# Altium project PCB_Project.PrjPCB
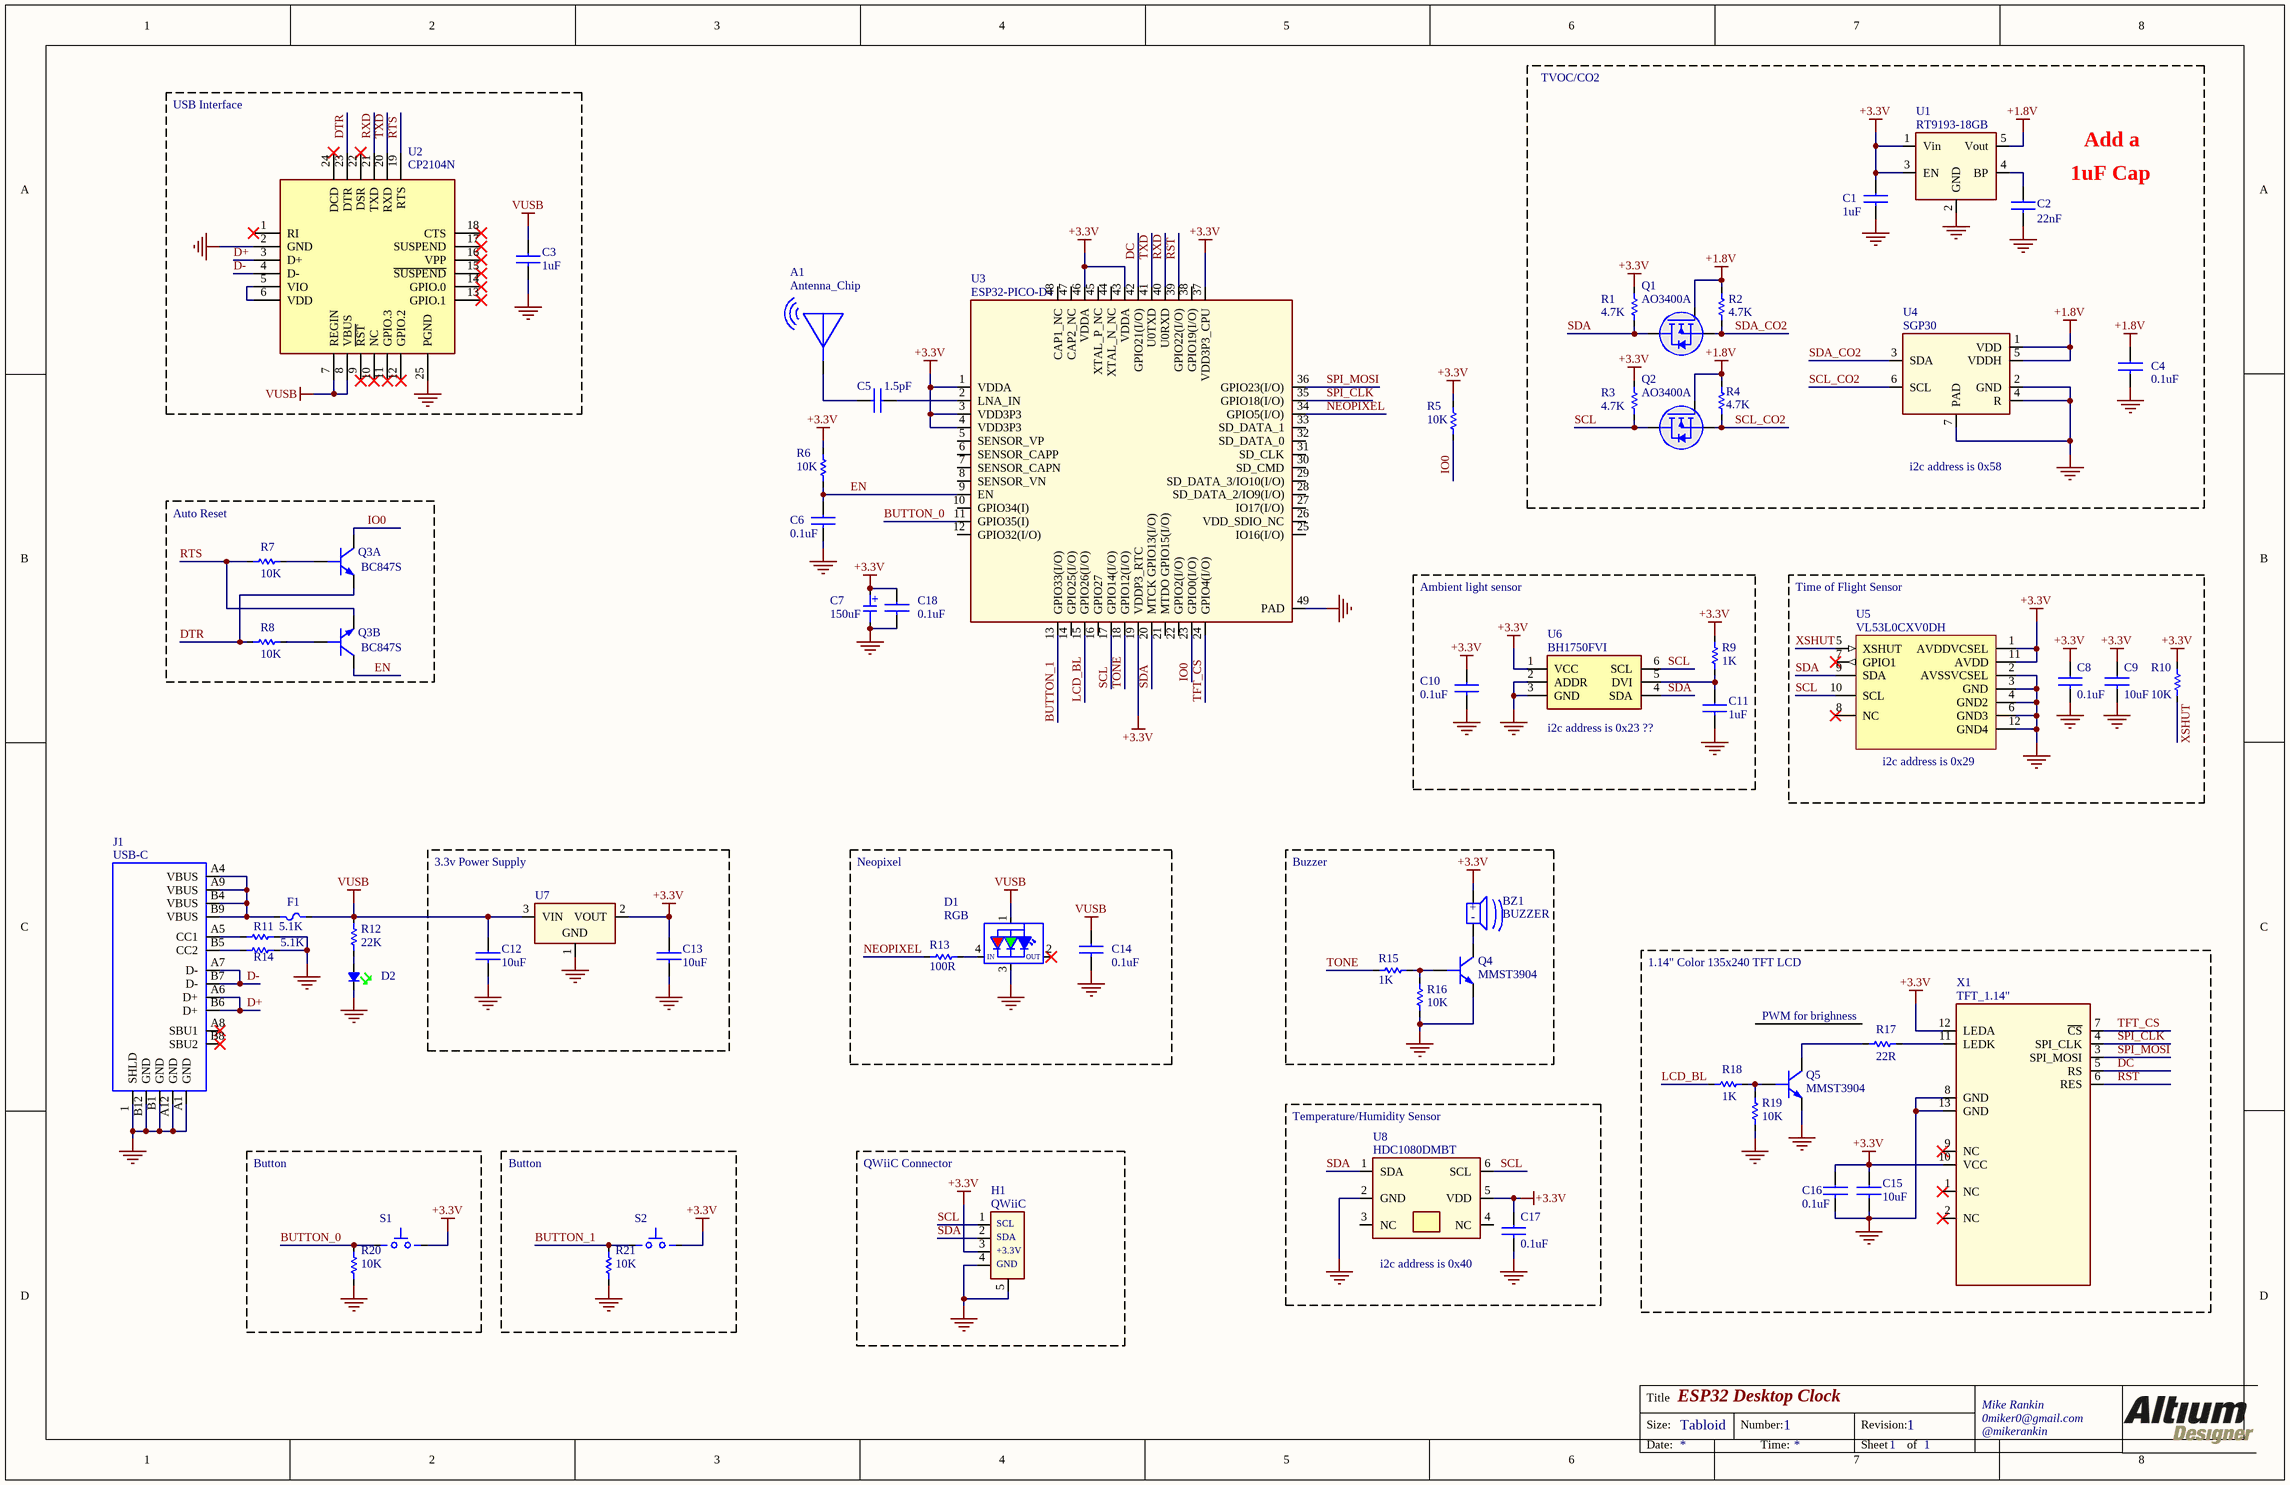
[diagram p0: Schematic_Rev1.SchDoc]
1 sheet, 62 parts. Net scope: global (net labels, ports and power ports of the same name join across sheets).
Board file: PCB_Rev1.PcbDoc

## Sheet Schematic_Rev1.SchDoc: ESP32 Desktop Clock
size Tabloid; DrawnBy: x; Engineer: x; Address1: Mike Rankin; Address2: 0miker0@gmail.com; Address3: @mikerankin; DocumentNumber: 1; Revision: 1; SheetNumber: 1; SheetTotal: 1; ImagePath: x

### Parts
A1  Antenna_Chip  [AN9520-245]
BZ1  BUZZER  [ST-025BH]
C1  1uF  [CAPC1005X56N]
C2  22nF  [CAPC1005X56N]
C3  1uF  [CAPC1005X56N]
C4  0.1uF  [CAPC1005X56N]
C5  1.5pF  [CAPC1005X56N]
C6  0.1uF  [CAPC1005X56N]
C7  150uF  [CAP_SM_CAN_0.250_DIA]
C8  0.1uF  [CAPC1005X56N]
C9  10uF  [CAPC2012X140N]
C10  0.1uF  [CAPC1005X56N]
C11  1uF  [CAPC1005X56N]
C12  10uF  [CAPC2012X140N]
C13  10uF  [CAPC2012X140N]
C14  0.1uF  [CAPC1005X56N]
C15  10uF  [CAPC2012X140N]
C16  0.1uF  [CAPC1005X56N]
C17  0.1uF  [CAPC1005X56N]
C18  0.1uF  [CAPC1005X56N]
D1  RGB  [SMD-5050]
D2  Green Led  [LED1005X40N-Green]  (value not drawn)
F1  TLC-PSMD050  [PTC2012X70L]  (value not drawn)
H1  QWiiC  [SM04B-SRSS-TB]
J1  USB-C  [TYPE-C-31-M-12]
Q1  (no value)  [SOT95P240X110-3N]
Q2  (no value)  [SOT95P240X110-3N]
Q3  BC847S  [SOT65P210X110-6N]  (parts A,B of 2)
Q4  MMST3904  [SC-70]
Q5  MMST3904  [SC-70]
R1  4.7K  [RESC1005X40L (0402 FOOTPRINT)]
R2  4.7K  [RESC1005X40L (0402 FOOTPRINT)]
R3  4.7K  [RESC1005X40L (0402 FOOTPRINT)]
R4  4.7K  [RESC1005X40L (0402 FOOTPRINT)]
R5  10K  [RESC1005X40L (0402 FOOTPRINT)]
R6  10K  [RESC1005X40L (0402 FOOTPRINT)]
R7  10K  [RESC1005X40L (0402 FOOTPRINT)]
R8  10K  [RESC1005X40L (0402 FOOTPRINT)]
R9  1K  [RESC1005X40L (0402 FOOTPRINT)]
R10  10K  [RESC1005X40L (0402 FOOTPRINT)]
R11  5.1K  [RESC1005X40L (0402 FOOTPRINT)]
R12  22K  [RESC1005X40L (0402 FOOTPRINT)]
R13  100R  [RESC1005X40L (0402 FOOTPRINT)]
R14  5.1K  [RESC1005X40L (0402 FOOTPRINT)]
R15  1K  [RESC1005X40L (0402 FOOTPRINT)]
R16  10K  [RESC1005X40L (0402 FOOTPRINT)]
R17  22R  [RESC1005X40L (0402 FOOTPRINT)]
R18  1K  [RESC1005X40L (0402 FOOTPRINT)]
R19  10K  [RESC1005X40L (0402 FOOTPRINT)]
R20  10K  [RESC1005X40L (0402 FOOTPRINT)]
R21  10K  [RESC1005X40L (0402 FOOTPRINT)]
S1  PushButton  [TSA063G70-250]  (value not drawn)
S2  PushButton  [TSA063G70-250]  (value not drawn)
U1  1.8V LDO  [SOT95P280X144-5N]  (value not drawn)
U2  CP2104N  [24-QFN]
U3  ESP32-PICO-D4  [QFN48_NEWEST 0.5mm pitch]
U4  SGP30  [DFN-6 (2.45mm X 2.45mm)]
U5  VL53L0CXV0DH  [VL53L0CXV0DH]
U6  BH1750FVI  [WSOF-6]
U7  NCP1117LPST33T3G  [SOT230P700X180-4N]  (value not drawn)
U8  HDC1080DMBT  [HDC1080]
X1  TFT_1.14"  [TFT_GLASS 1.14 INCH]

### Blocks framed on the sheet
USB Interface: C3 U2
Auto Reset: Q3 R7 R8
3.3v Power Supply: C12 C13 U7
Neopixel: C14 D1 R13
Buzzer: BZ1 Q4 R15 R16
Button: R20 S1
Button: R21 S2
QWiiC Connector: H1

### Nets
+1.8V: C4.1 Q1.1(G) Q2.1(G) R2.2 R4.2 U1.5(Vout) U4.1(VDD) U4.5(VDDH)
+3.3V: BZ1.1 C1.1 C7.1 C8.1 C9.1 C10.1 C13.1 C15.1 C16.1 C17.1 C18.1 H1.3 R1.2 R3.2 R5.1 R6.1 R9.2 R10.1 S1.2(B) S2.2(B) U1.1(Vin) U1.3(EN) U3.1(VDDA) U3.3(VDD3P3) U3.4(VDD3P3) U3.19(VDDP3_RTC) U3.37(VDD3P3_CPU) U3.43(VDDA) U3.46(VDDA) U5.1(AVDDVCSEL) U5.11(AVDD) U6.1(VCC) U7.2(VOUT) U8.5(VDD) X1.10(VCC) X1.12(LEDA)
GND: C1.2 C2.2 C3.2 C4.2 C6.2 C7.2 C8.2 C9.2 C10.2 C11.2 C12.2 C13.2 C14.2 C15.2 C16.2 C17.2 C18.2 D1.3 D2.1 H1.4 H1.5 J1.1(SHLD) J1.A1(GND) J1.A12(GND) J1.B1(GND) J1.B12(GND) Q4.2(E) Q5.2(E) R11.2 R14.2 R16.2 R19.2 R20.2 R21.2 U1.2(GND) U2.2(GND) U2.25(PGND) U3.49(PAD) U4.2(GND) U4.4(R) U4.7(PAD) U5.2(AVSSVCSEL) U5.3(GND) U5.4(GND2) U5.6(GND3) U5.12(GND4) U6.2(ADDR) U6.3(GND) U7.1(GND) U8.2(GND) X1.8(GND) X1.13(GND)
VUSB: C3.1 C12.1 C14.1 D1.1 F1.1 R12.2 U2.7(REGIN) U2.8(VBUS) U7.3(VIN)
BUTTON_0: R20.1 S1.1(A) U3.11(GPIO35(I))
BUTTON_1: R21.1 S2.1(A) U3.13(GPIO33(I/O))
D+: J1.A6(D+) J1.B6(D+) U2.3(D+)
D-: J1.A7(D-) J1.B7(D-) U2.4(D-)
DC: U3.42(GPIO21(I/O)) X1.5(RS)
DTR: Q3.1(E1) R8.2 U2.23(DTR)
EN: C6.1 Q3.3(C2) R6.2 U3.9(EN)
IO0: Q3.6(C1) R5.2 U3.23(GPIO0(I/O))
LCD_BL: R18.1 U3.15(GPIO26(I/O))
NEOPIXEL: R13.2 U3.34(GPIO5(I/O))
RST: U3.39(GPIO22(I/O)) X1.6(RES)
RTS: Q3.4(E2) R7.2 U2.19(RTS)
RXD: U2.21(TXD) U3.40(U0RXD)
SCL: H1.1 Q2.3(D) R3.1 U3.17(GPIO14(I/O)) U5.10(SCL) U6.6(SCL) U8.6(SCL)
SCL_CO2: Q2.2(S) R4.1 U4.6(SCL)
SDA: H1.2 Q1.3(D) R1.1 U3.20(MTCK_GPIO13(I/O)) U5.9(SDA) U6.4(SDA) U8.1(SDA)
SDA_CO2: Q1.2(S) R2.1 U4.3(SDA)
SPI_CLK: U3.35(GPIO18(I/O)) X1.4(SPI_CLK)
SPI_MOSI: U3.36(GPIO23(I/O)) X1.3(SPI_MOSI)
TFT_CS: U3.24(GPIO4(I/O)) X1.7(~{CS})
TONE: R15.2 U3.18(GPIO12(I/O))
TXD: U2.20(RXD) U3.41(U0TXD)
XSHUT: R10.2 U5.5(XSHUT)
NetA1_1: A1.1 C5.2
NetBZ1_2: BZ1.2 Q4.3(C)
NetC2_1: C2.1 U1.4(BP)
NetC5_1: C5.1 U3.2(LNA_IN)
NetC11_1: C11.1 R9.1 U6.5(DVI)
NetD1_4: D1.4 R13.1
NetD2_2: D2.2 R12.1
NetF1_2: F1.2 J1.A4(VBUS) J1.A9(VBUS) J1.B4(VBUS) J1.B9(VBUS)
NetJ1_A5: J1.A5(CC1) R11.1
NetJ1_B5: J1.B5(CC2) R14.1
NetQ3_2: Q3.2(B1) R7.1
NetQ3_5: Q3.5(B2) R8.1
NetQ4_1: Q4.1(B) R15.1 R16.1
NetQ5_1: Q5.1(B) R18.2 R19.1
NetQ5_3: Q5.3(C) R17.2
NetR17_1: R17.1 X1.11(LEDK)
NetU2_5: U2.5(VIO) U2.6(VDD)

Not connected (* = marked no-connect by the designer): D1 2(DIN)*; J1 A8(SBU1)* B8(SBU2)*; U2 1(RI)* 9(~{RST})* 10(NC)* 11(GPIO.3)* 12(GPIO.2)* 13(GPIO.1)* 14(GPIO.0)* 15(~{SUSPEND})* 16(VPP)* 17(SUSPEND)* 18(CTS)* 22(DSR)* 24(DCD)*; U3 5(SENSOR_VP) 6(SENSOR_CAPP) 7(SENSOR_CAPN) 8(SENSOR_VN) 10(GPIO34(I)) 12(GPIO32(I/O)) 14(GPIO25(I/O)) 16(GPIO27) 21(MTDO_GPIO15(I/O)) 22(GPIO2(I/O)) 25(IO16(I/O)) 26(VDD_SDIO_NC) 27(IO17(I/O)) 28(SD_DATA_2/IO9(I/O)) 29(SD_DATA_3/IO10(I/O)) 30(SD_CMD) 31(SD_CLK) 32(SD_DATA_0) 33(SD_DATA_1) 38(GPIO19(I/O)) 44(XTAL_N_NC) 45(XTAL_P_NC) 47(CAP2_NC) 48(CAP1_NC); U5 7(GPIO1)* 8(NC)*; U8 3(NC) 4(NC); X1 1(NC)* 2(NC)* 9(NC)*

### Notes on the sheet
- TVOC/CO2
- Add a
- 1uF Cap
- (near U4) i2c address is 0x58
- Ambient light sensor
- Time of Flight Sensor
- i2c address is 0x23 ??
- (near U5) i2c address is 0x29
- 1.14" Color 135x240 TFT LCD
- (near R17) PWM for brighness
- (near U8) Temperature/Humidity Sensor
- i2c address is 0x40
- Labels drawn without touching a wire or pin: \
- Title
- Size:
- Tabloid
- Number:
- Revision:
- Date:
- Time:
- Sheet
- of
- (in symbol Buzzer_SMT) +; -
- (in symbol CAP_ELEC_SMT) +
- (in symbol SM04B-SRSS-TB) SCL; SDA; +3.3V; GND
- (in symbol WS2812) IN; OUT

### Library data of the parts
A1 = Antenna_Chip: Antenna Chip 2.4Gig; Manufacturer: Rainsun; Part_Number: C99665; Value: Chip Antenna; Vendor: LCSC
BZ1 = Buzzer_SMT: BUZZER MAGNETIC 2.7kHz Tone 2-4V SMD; Manufacturer: SOBERTON; Vendor: Digi-Key; Part_Number: ST-025BH
C1 = CAP_0402: CAP 1uF 0402; Part_Footprint: 0402; Value: 1uF
C2 = CAP_0402: CAP 22nF 0402; Part_Footprint: 0402; Vendor: LCSC; Value: 22nF
C3 C11 = CAP_0603: CAP 1uF 16V 0402; PartNumber: C83063; Manufacturer: Walsin; Vendor: LCSC; Value: 1uF
C4 C10 C14 C18 = CAP_0402: CAP 0.1uF 0402; Part_Footprint: 0402; Value: 0.1uF
C5 = CAP_0402: CAP 1.5pF 0402; Part_Number: C147344; Manufacturer: Dafron; Part_Footprint: 0402; Vendor: LCSC; Value: 1.5pF
C6 C8 C16 C17 = CAP_0402: CAP 0.1uF 0402; PartNumber: C344190; Manufacturer: CCTC; Vendor: LCSC; Value: 0.1uF
C7 = CAP_ELEC_SMT: CAP 150uF, 10V SMT; Part_Number: C242018; Manufacturer: Suncon; Part_Footprint: SMD,6.3x6mm; Vendor: LCSC; Value: 150uF
C9 C15 = CAP_0805: CAP 10uF 0805; Manufacturer: Samsung; PartNumber: C307520; Vendor: LCSC; Value: 10uF
C12 C13 = CAP_0805: CAP 10uF 16V 0805; PartNumber: C162317; Manufacturer: Murata; Part_Footprint: 0805; Vendor: LCSC; Value: 10uF
D1 = WS2812: LED,RGB,NEOPIXEL,WS2818; Part_Number: C139127; Manufacturer: Worldsemi; Vendor: LCSC; Part_Footprint: SMD-5050; Value: NeoPixel
D2 = LED_0402_SMALL_GREEN: LED Green 0402; Part_Number: C74338; Part_Footprint: 0402; Vendor: LCSC; Value: Green Led
F1 = PTC_FUSE: PTC FUSE 500mA hold, 1A trip 0805 SMD; Manufacturer: TLC; Vendor: LCSC; LCSC_Part_Number: C261942; Value: TLC-PSMD050; Man_Part_Number: TLC-PSMD050
H1 = SM04B-SRSS-TB: CONN HEADER 4POS .100 R/A QWIIC; Manufacturer: JST; PartNumber: SM04B-SRSS-TB(LF)(SN); Vendor: Digi-Key; Value: QWiiC
J1 = USB-C: CONN RECPT USB-C; Manufacturer: KHE; Part_Number: C165948; Part_Footprint: SMT; Vendor: LCSC; Value: USB-C
Q1 Q2 = AO3400A: MOSFET N-CH 30V 35.7A SOT-23; Manufacturer: Alpha & Omega; Vendor: Digi-Key; Part_Footprint: SOT-23; PartNumber: AO3400A
Q3 = BC847S: TRANS 2NPN 44V 0.1A SC-70-6; Manufacturer: Changjiang; Vendor: LCSC; PartNumber: BC847S; Value: 2NPN
Q4 Q5 = MMST3904: TRANSISTOR NPN GP 40V SC-70; Manufacturer: Changjiang; Part_Number: C54879; Vendor: LCSC; Part_Footprint: SC-70; Value: MMST3904
R1-R4 = RES_0402: RES 4.7K 0402; Value: 4.7K
R5-R8 R10 R16 R19 = RES_0402: RES 10K 0402; PartNumber: C258091; Manufacturer: Guangdong; Vendor: LCSC; Value: 10K
R9 R18 = RES_0402: RES 1K 0402; PartNumber: C106235; Manufacturer: Yageo; Vendor: LCSC; Value: 1K
R11 R14 = RES_0603: RES 5.1K 0402; Vendor: LCSC; Value: 5.1K
R12 = RES_0603: RES 22K 0402; Manufacturer: LIZ Elec; PartNumber: C100310; Vendor: LCSC; Value: 22K
R13 = RES_0603: RES 100R 0402; Manufacturer: Yageo; Man_Part_Number: RC0402FR-07100RL; Vendor: LCSC; LCSC_Part_Number: C106232; Value: 100R
R15 = RES_0402: RES 1K 0402; Vendor: Digi-Key; Value: 1K
R17 = RES_0402: RES 22R 0402; PartNumber: C25092; Manufacturer: Uniroyal; Vendor: LCSC; Value: 22R
R20 R21 = RES_0402: RES 10K 0402; Part_Number: C258091; Manufacturer: Guangdong; Part_Footprint: 0402; Vendor: LCSC; Value: 10K
S1 S2 = TSA063G70-250: SWITCH TACTILE SPST-NO; PartNumber: C294567; Manufacturer: Bright; Part_Footprint: SMD,6.1x6.1x3.5mm; Vendor: LCSC; Value: PushButton
U1 = RT9193-18GB: IC REG LDO 1.8V 300mA SOT23-5; Manufacturer: Richtek USA; Vendor: Digi-Key; Part_Footprint: SOT23-5; PartNumber: RT9193-18GB; Value: 1.8V LDO
U2 = CP2104N: IC BRIDGE USB TO UART 24QFN; Manufacturer: Silicon Labs; PartNumber: C47742; Vendor: LCSC; Part_Footprint: 24QFN; Value: CP2104N
U3 = ESP32-PICO-D4: RF Transceiver ICs QFN-48_7x7x05P RoHS; Manufacturer: Espressif; PartNumber: C193707; Vendor: LCSC; Value: ESP32-PICO-D4
U4 = SGP30: TVOC/CO2 Sensor; Manufacturer: Sensirion AG; Part_Footprint: 6-DFN; PartNumber: SGP30-2.5K; Vendor: Digi-Key; Value: SGP30
U5 = VL53L0CXV0DH: LASER SENSOR; Manufacturer: ST MICRO; PartNumber: C91199; Value: VL53L0CXV0DH/1; Vendor: LCSC
U6 = BH1750FVI: Optical Sensor Ambient I2C 6-SMD; Manufacturer: Rohm; Part_Footprint: 6WSOF; Part_Number: C78960; Vendor: LCSC; Value: BH1750FVI
U7 = NCP1117LPST33T3G: IC REG LDO 3.3V 1A SOT223-3; Manufacturer: ON Semi; Vendor: Digi-Key; Value: 3.3V 1A LDO; PartNumber: NCP1117LPST33T3G
U8 = HDC1080DMBT: Humidity/Temperature Sensor; Manufacturer: Texas Instruments; PartNumber: C82227; Vendor: LCSC; Value: HDC1080DMBT
X1 = TFT_GLASS 1.14 INCH COLOR: 1.14 INCH TFT GLASS COLOR; Part_Number: ER-TFT1.14-1; Manufacturer: BuyDisplay; Vendor: BuyDisplay; Value: TFT_1.14"